# EAGLE schematic LinearOptoMixer (EAGLE 6.5.0)
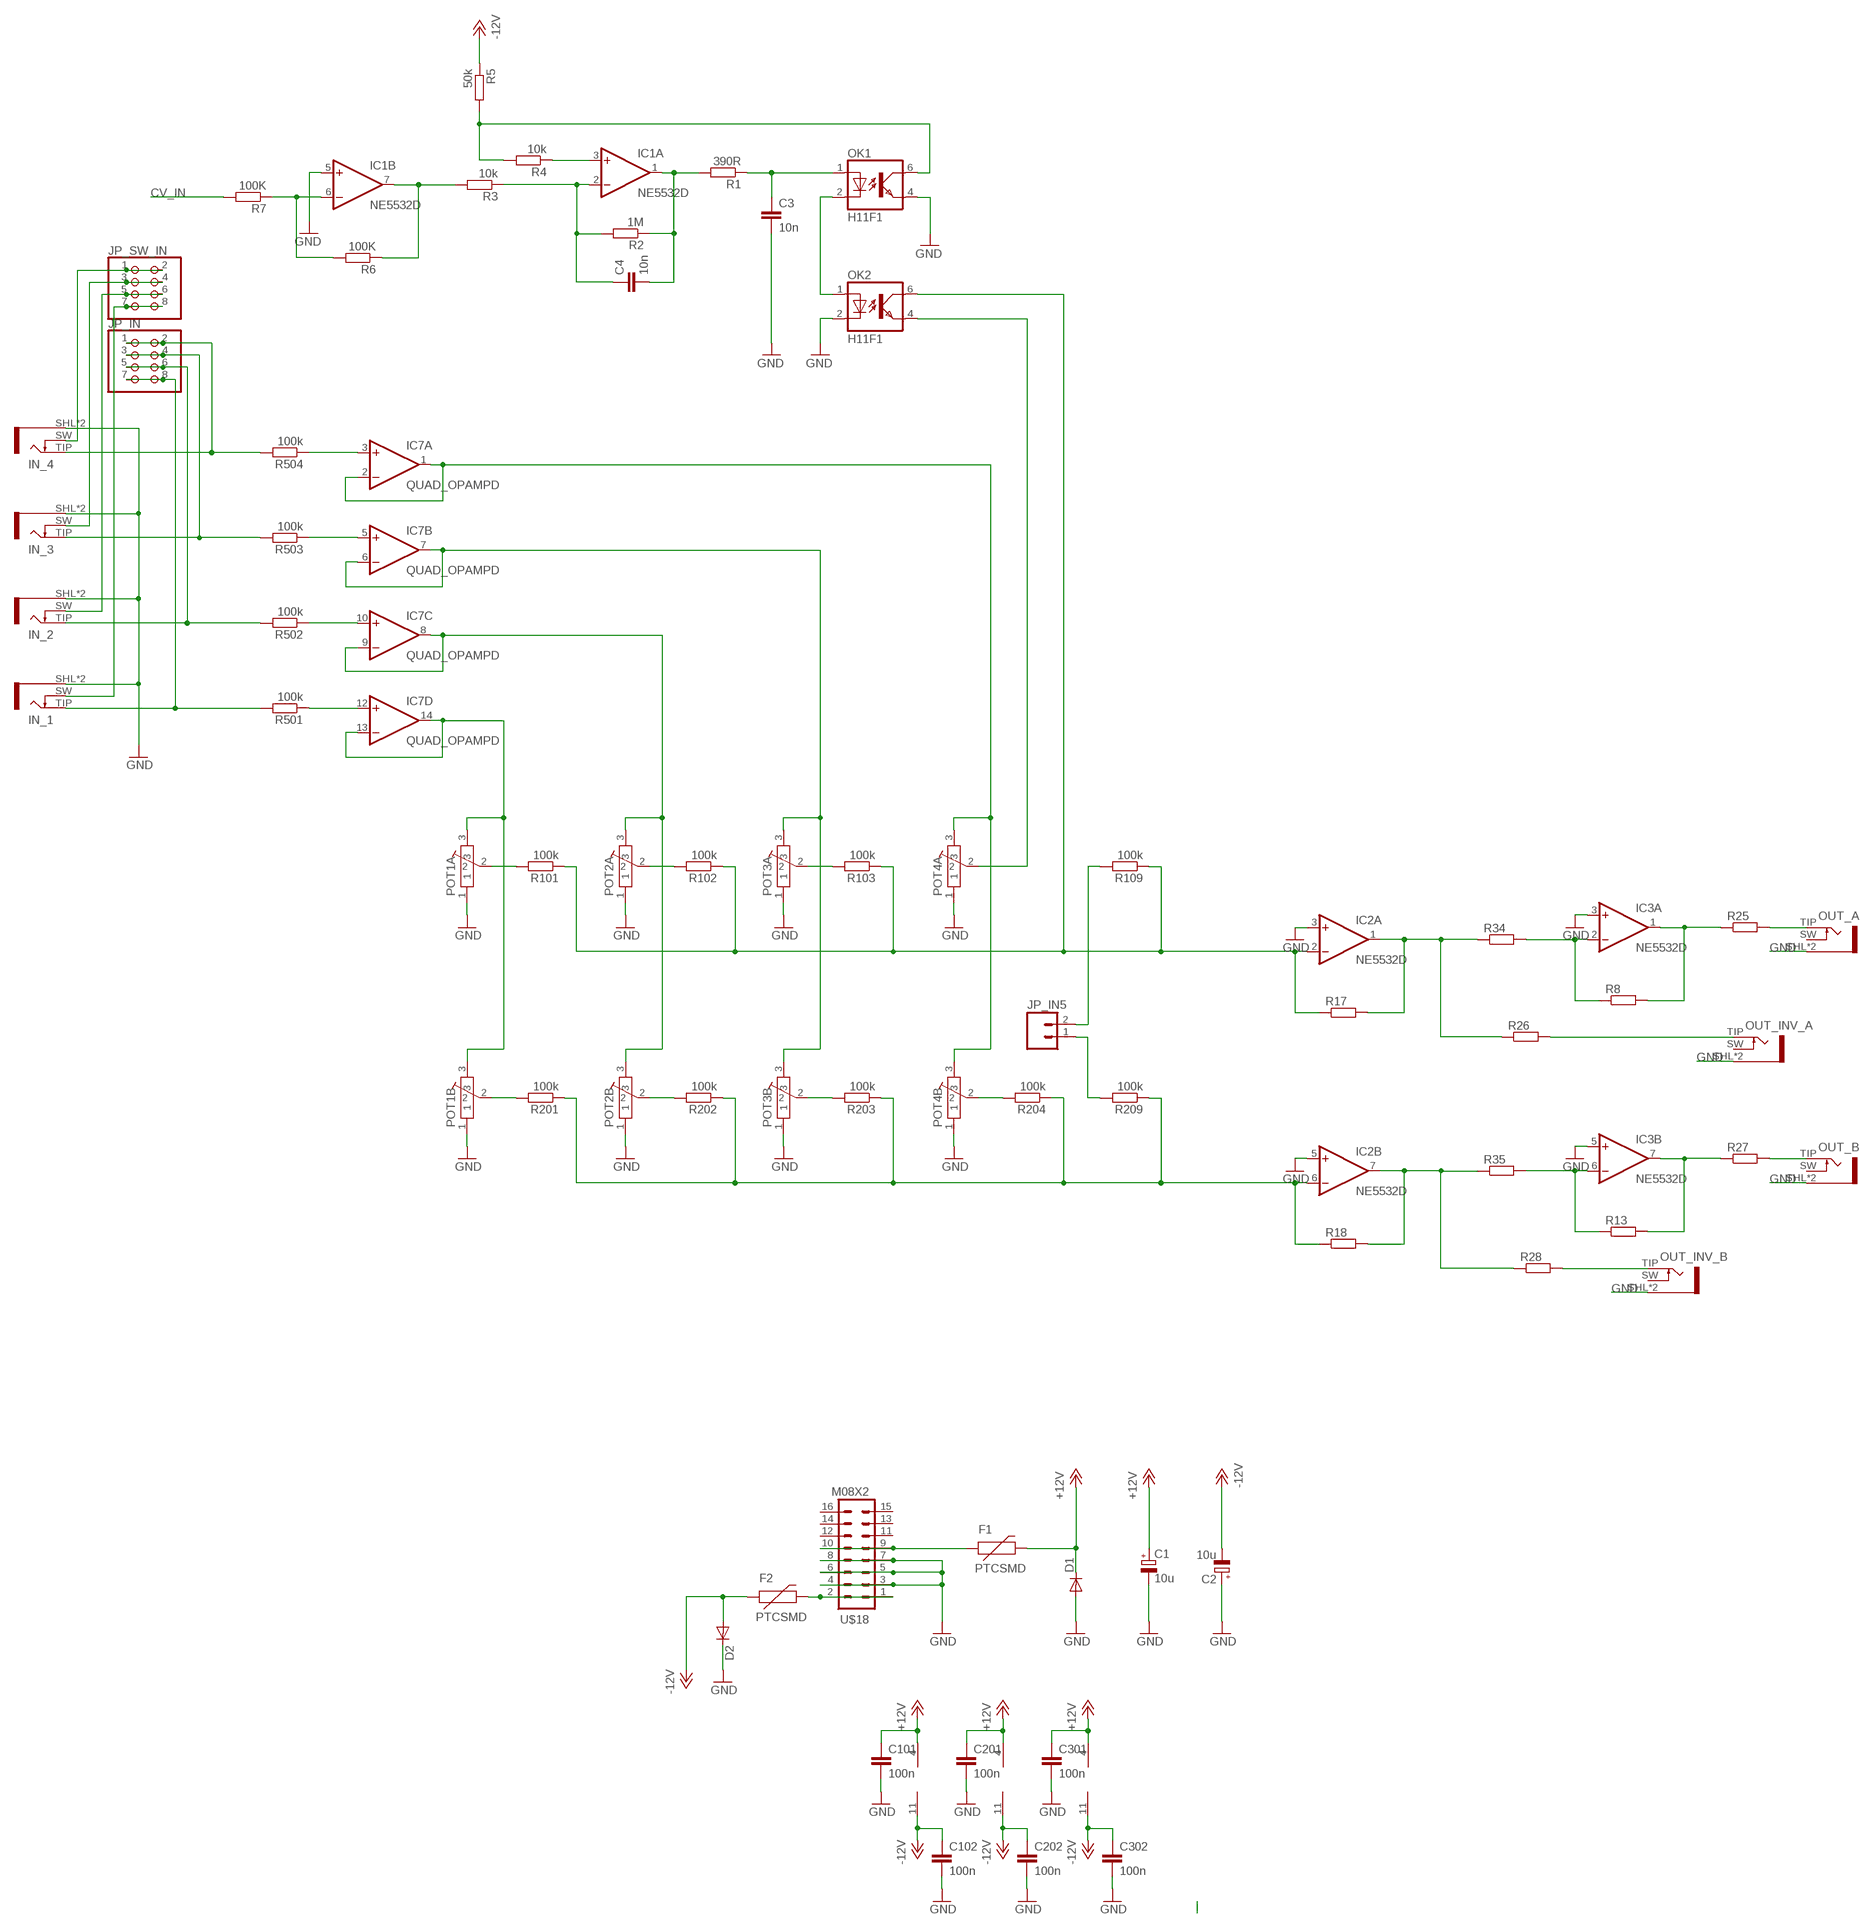
[diagram p0: schematic, sheet 1]

## Parts
C1  10u  CPOL-EUA  [PANASONIC_A]
C2  10u  CPOL-EUA  [PANASONIC_A]
C3  10n  C-EUC0603  [C0603]
C4  10n  C-EUC0603  [C0603]
C101  100n  C-EUC0603  [C0603]
C102  100n  C-EUC0603  [C0603]
C201  100n  C-EUC0603  [C0603]
C202  100n  C-EUC0603  [C0603]
C301  100n  C-EUC0603  [C0603]
C302  100n  C-EUC0603  [C0603]
D1  DIODESMA  [SMA-DIODE]
D2  DIODESMA  [SMA-DIODE]
F1  PTCSMD  [PTC-1206]
F2  PTCSMD  [PTC-1206]
IC1  NE5532D  [SO08]
IC2  NE5532D  [SO08]
IC3  NE5532D  [SO08]
IC4  QUAD_OPAMPD  [SO14]
IC5  QUAD_OPAMPD  [SO14]
IC6  QUAD_OPAMPD  [SO14]
IC7  QUAD_OPAMPD  [SO14]
IN_1  JACK-PJ-301B  [PJ-301B]
IN_2  JACK-PJ-301B  [PJ-301B]
IN_3  JACK-PJ-301B  [PJ-301B]
IN_4  JACK-PJ-301B  [PJ-301B]
JP_IN  PINHD-2X4  [2X04]
JP_IN5  M02PTH  [1X02]
JP_SW_IN  PINHD-2X4  [2X04]
OK1  H11F1  [DIL05]
OK2  H11F1  [DIL05]
OUT_A  JACK-PJ-301B  [PJ-301B]
OUT_B  JACK-PJ-301B  [PJ-301B]
OUT_INV_A  JACK-PJ-301B  [PJ-301B]
OUT_INV_B  JACK-PJ-301B  [PJ-301B]
POT1A  POT-ALPS-RK09L1140  [POT-ALPS-RK09L1140]
POT1B  POT-ALPS-RK09L1140  [POT-ALPS-RK09L1140]
POT2A  POT-ALPS-RK09L1140  [POT-ALPS-RK09L1140]
POT2B  POT-ALPS-RK09L1140  [POT-ALPS-RK09L1140]
POT3A  POT-ALPS-RK09L1140  [POT-ALPS-RK09L1140]
POT3B  POT-ALPS-RK09L1140  [POT-ALPS-RK09L1140]
POT4A  POT-ALPS-RK09L1140  [POT-ALPS-RK09L1140]
POT4B  POT-ALPS-RK09L1140  [POT-ALPS-RK09L1140]
R1  390R  R-EU_R0603  [R0603]
R2  1M  R-EU_R0603  [R0603]
R3  10k  R-EU_R0603  [R0603]
R4  10k  R-EU_R0603  [R0603]
R5  50k  R-EU_R0603  [R0603]
R6  100K  R-EU_R0603  [R0603]
R7  100K  R-EU_R0603  [R0603]
R8  R-EU_R0603  [R0603]
R13  R-EU_R0603  [R0603]
R17  R-EU_R0603  [R0603]
R18  R-EU_R0603  [R0603]
R25  R-EU_R0603  [R0603]
R26  R-EU_R0603  [R0603]
R27  R-EU_R0603  [R0603]
R28  R-EU_R0603  [R0603]
R34  R-EU_R0603  [R0603]
R35  R-EU_R0603  [R0603]
R101  100k  R-EU_R0603  [R0603]
R102  100k  R-EU_R0603  [R0603]
R103  100k  R-EU_R0603  [R0603]
R109  100k  R-EU_R0603  [R0603]
R201  100k  R-EU_R0603  [R0603]
R202  100k  R-EU_R0603  [R0603]
R203  100k  R-EU_R0603  [R0603]
R204  100k  R-EU_R0603  [R0603]
R209  100k  R-EU_R0603  [R0603]
R501  100k  R-EU_R0603  [R0603]
R502  100k  R-EU_R0603  [R0603]
R503  100k  R-EU_R0603  [R0603]
R504  100k  R-EU_R0603  [R0603]
U$18  M08X2  [2X8]

## Nets
+12V: C1.+ C101.1 C201.1 C301.1 D1.C F1.2 IC4.4(P:V+) IC5.4(P:V+) IC6.4(P:V+)
-12V: C2.- C102.1 C202.1 C302.1 D2.A F2.1 IC4.11(P:V-) IC5.11(P:V-) IC6.11(P:V-) R5.1
CV_IN: R7.2
GND: C1.- C2.+ C3.2 C101.2 C102.2 C201.2 C202.2 C301.2 C302.2 D1.A D2.C IC1.5(B:+IN) IC2.3(A:+IN) IC2.5(B:+IN) IC3.3(A:+IN) IC3.5(B:+IN) IN_1.SHL(SLEEVE) IN_1.SLV(SLEEVE) IN_2.SHL(SLEEVE) IN_2.SLV(SLEEVE) IN_3.SHL(SLEEVE) IN_3.SLV(SLEEVE) IN_4.SHL(SLEEVE) IN_4.SLV(SLEEVE) OK1.4(EMIT) OK2.2(C) OUT_A.SHL(SLEEVE) OUT_A.SLV(SLEEVE) OUT_B.SHL(SLEEVE) OUT_B.SLV(SLEEVE) OUT_INV_A.SHL(SLEEVE) OUT_INV_A.SLV(SLEEVE) OUT_INV_B.SHL(SLEEVE) OUT_INV_B.SLV(SLEEVE) POT1A.1 POT1B.1 POT2A.1 POT2B.1 POT3A.1 POT3B.1 POT4A.1 POT4B.1 U$18.3 U$18.4 U$18.5 U$18.6 U$18.7 U$18.8
N$1: IC2.1(A:OUT) R17.2 R26.1 R34.1
N$2: C4.1 IC1.2(A:-IN) R2.2 R3.1
N$3: OK1.2(C) OK2.1(A)
N$4: C4.2 IC1.1(A:OUT) R1.2 R2.1
N$5: IC3.7(B:OUT) R13.2 R27.1
N$6: IC3.1(A:OUT) R8.2 R25.1
N$7: IC1.7(B:OUT) R3.2 R6.1
N$8: IC1.6(B:-IN) R6.2 R7.1
N$9: OUT_A.TIP R25.2
N$11: OUT_INV_A.TIP R26.2
N$12: OK1.6(COL) R4.2 R5.2
N$14: IC2.7(B:OUT) R18.2 R28.1 R35.1
N$15: OUT_B.TIP R27.2
N$16: IC1.3(A:+IN) R4.1
N$17: OUT_INV_B.TIP R28.2
N$18: IC3.2(A:-IN) R8.1 R34.2
N$20: POT1B.2 R201.2
N$23: IC3.6(B:-IN) R13.1 R35.2
N$27: IC7.8(C:OUT) IC7.9(C:-IN) POT2A.3 POT2B.3
N$29: POT1A.2 R101.2
N$30: POT2B.2 R202.2
N$31: POT3B.2 R203.2
N$33: IN_1.TIP JP_IN.7 JP_IN.8 R501.2
N$34: IC7.13(D:-IN) IC7.14(D:OUT) POT1A.3 POT1B.3
N$35: IN_4.TIP JP_IN.1 JP_IN.2 R504.2
N$36: IN_3.TIP JP_IN.3 JP_IN.4 R503.2
N$37: IN_2.TIP JP_IN.5 JP_IN.6 R502.2
N$38: IN_4.SW JP_SW_IN.1 JP_SW_IN.2
N$39: IN_3.SW JP_SW_IN.3 JP_SW_IN.4
N$40: IN_2.SW JP_SW_IN.5 JP_SW_IN.6
N$41: IN_1.SW JP_SW_IN.7 JP_SW_IN.8
N$42: IC7.3(A:+IN) R504.1
N$43: IC7.5(B:+IN) R503.1
N$44: POT4B.2 R204.2
N$47: OK2.4(EMIT) POT4A.2
N$48: IC7.10(C:+IN) R502.1
N$49: POT3A.2 R103.2
N$50: IC7.12(D:+IN) R501.1
N$51: POT2A.2 R102.2
N$52: IC2.2(A:-IN) OK2.6(COL) R17.1 R101.1 R102.1 R103.1 R109.1
N$53: IC7.6(B:-IN) IC7.7(B:OUT) POT3A.3 POT3B.3
N$56: F1.1 U$18.9 U$18.10
N$57: F2.2 U$18.1 U$18.2
N$58: IC7.1(A:OUT) IC7.2(A:-IN) POT4A.3 POT4B.3
N$61: IC2.6(B:-IN) R18.1 R201.1 R202.1 R203.1 R204.1 R209.1
N$62: JP_IN5.1 R209.2
N$63: JP_IN5.2 R109.2
N$82: C3.1 OK1.1(A) R1.1
Unconnected: IC4.1(A:OUT) IC4.2(A:-IN) IC4.3(A:+IN) IC4.5(B:+IN) IC4.6(B:-IN) IC4.7(B:OUT) IC4.8(C:OUT) IC4.9(C:-IN) IC4.10(C:+IN) IC4.12(D:+IN) IC4.13(D:-IN) IC4.14(D:OUT) IC5.1(A:OUT) IC5.2(A:-IN) IC5.3(A:+IN) IC5.5(B:+IN) IC5.6(B:-IN) IC5.7(B:OUT) IC5.8(C:OUT) IC5.9(C:-IN) IC5.10(C:+IN) IC5.12(D:+IN) IC5.13(D:-IN) IC5.14(D:OUT) IC6.1(A:OUT) IC6.2(A:-IN) IC6.3(A:+IN) IC6.5(B:+IN) IC6.6(B:-IN) IC6.7(B:OUT) IC6.8(C:OUT) IC6.9(C:-IN) IC6.10(C:+IN) IC6.12(D:+IN) IC6.13(D:-IN) IC6.14(D:OUT) OUT_A.SW OUT_B.SW OUT_INV_A.SW OUT_INV_B.SW POT1A.P$5 POT1A.P$6 POT1B.P$5 POT1B.P$6 POT2A.P$5 POT2A.P$6 POT2B.P$5 POT2B.P$6 POT3A.P$5 POT3A.P$6 POT3B.P$5 POT3B.P$6 POT4A.P$5 POT4A.P$6 POT4B.P$5 POT4B.P$6 U$18.11 U$18.12 U$18.13 U$18.14 U$18.15 U$18.16

## Power pins joined to a net without a drawn wire
V+: IC1.8(P:V+) IC2.8(P:V+) IC3.8(P:V+) IC7.4(P:V+)
V-: IC1.4(P:V-) IC2.4(P:V-) IC3.4(P:V-) IC7.11(P:V-)

## Library data of the parts
C1 C2 = resistor:CPOL-EU: POLARIZED CAPACITOR, European symbol
C3 C4 C101 C102 C201 C202 C301 C302 = resistor:C-EU: CAPACITOR, European symbol
D1 D2 = SparkFun:DIODE: Diode These are standard reverse protection diodes and small signal diodes. SMA package can handle up to about 1A. SOD-323 can handle about 200mA. What the SOD-323 package when ordering, there are some mfgs out there that are 5-pin packages.
F1 F2 = SparkFun:PTC: Resettable Fuse PTC Resettable Fuse. Spark Fun Electronics SKU : COM-08357
IC1-IC3 = linear:NE5532: AUDIO AMPLIFIER
IC4-IC7 = adafruit:QUAD_OPAMP: OP AMP Standard quad package
IN_1-IN_4 OUT_A OUT_B OUT_INV_A OUT_INV_B = Rebel:JACK-PJ-301B
JP_IN JP_SW_IN = adafruit:PINHD-2X4: PIN HEADER
JP_IN5 = SparkFun:M02: Header 2 Standard 2-pin 0.1" header. Use with straight break away headers (SKU : PRT-00116), right angle break away headers (PRT-00553), swiss pins (PRT-00743), machine pins (PRT-00117), and female headers (PRT-00115). Molex polarized connector foot print use with SKU : PRT-08233 with associated crimp pins and housings.
OK1 OK2 = optocoupler:H11F1: OPTO COUPLER OPTO COUPLER; OC_FARNELL: unknown; OC_NEWARK: unknown
POT1A POT1B POT2A POT2B POT3A POT3B POT4A POT4B = Rebel:POT-ALPS-RK09L
R1-R8 R13 R17 R18 R25-R28 R34 R35 R101-R103 R109 R201-R204 R209 R501-R504 = resistor:R-EU_: RESISTOR, European symbol
U$18 = SparkFun:M08X2